# Altium schematic sheet MDL_FUENTE_5V.SchDoc
size A4
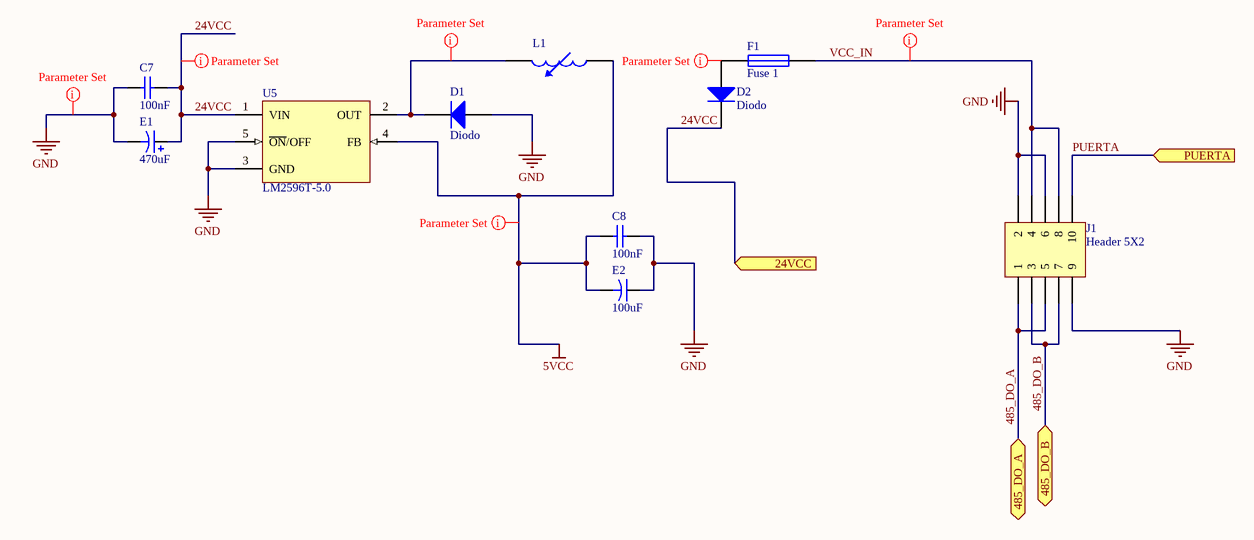
[diagram p0: MDL_FUENTE_5V.SchDoc]

## Parts
C7  value 100nF  [VP44-2.5]  (hidden comment: VP44BY224JB)
C8  value 100nF  [VP44-2.5]  (hidden comment: VP44BY224JB)
D1  Diodo  [1N4000]
D2  Diodo  [1N4000]
E1  value 470uF  [C1000UF]  (hidden comment: Cap Pol1)
E2  value 100uF  [C1UF]  (hidden comment: Cap2)
F1  Fuse 1  [FUSIBLE_BUSMATIC]
J1  Header 5X2  [FP_CON10]
L1  Inductor Adj  [Inductor_redondo]  (value not drawn)
U5  LM2596T-5.0  [FP_LM2596_D_PCB]

## Ports
24VCC (in), 485_DO_A, 485_DO_B, PUERTA (in)

## Nets
5VCC: C8.2 E2.2 L1.1 U5.4(FB)
GND: C7.2 C8.1 D1.1(A) E1.2 E2.1 J1.2 J1.6 J1.9 U5.3(GND) U5.5(~{ON}/OFF)
24VCC: C7.1 D2.2(K) E1.1 U5.1(VIN) ; port 24VCC
485_DO_A: J1.1 J1.5 ; port 485_DO_A
485_DO_B: J1.3 J1.7 ; port 485_DO_B
PUERTA: J1.10 ; port PUERTA
VCC_IN: F1.2 J1.4 J1.8
NetD1_2: D1.2(K) L1.2 U5.2(OUT)
NetD2_1: D2.1(A) F1.1

## Layout directives
rule Width Constraint [Pref Width = 1.2mm    Min Width = 0.8mm    Max Width = 1.5mm]: GND
rule Width Constraint [Pref Width = 1.5mm    Min Width = 1.2mm    Max Width = 2mm]: 24VCC, VCC_IN
rule Width Constraint [Pref Width = 1.2mm    Min Width = 0.8mm    Max Width = 1.5mm]; rule Undefined: 5VCC
rule Width Constraint [Pref Width = 1.5mm    Min Width = 0.8mm    Max Width = 1.5mm]: NetD1_2
rule Width Constraint [Pref Width = 1.8mm    Min Width = 1.2mm    Max Width = 2mm]: NetD2_1

## Library data of the parts
C7 C8 = VP44BY224JB: Dipped Radial Multilayer Ceramic Capacitor X7R: 220nF, 100V; Published: 17-Dec-2003; DatasheetDocument: 4-Feb-2002; PackageDocument: 4-Feb-2002; PackageReference: VP44-2.5; Publisher: Altium Limited; ComponentLink1Description: Manufacturer Link; ComponentLink1URL: http://www.vishay.com/
D1 D2 = Diodo: Diodo rectificador
E1 = Cap Pol1: Polarized Capacitor (Radial); Published: 8-Jun-2000; LatestRevisionDate: 17-Jul-2002; LatestRevisionNote: Re-released for DXP Platform.; PackageReference: RB7.6-15; Publisher: Altium Limited
E2 = Cap2: Capacitor; Published: 23-Sep-2002; PackageReference: CAPR5-4X5; Publisher: Altium Limited; PackageDescription: Capacitor; 2 Leads
F1 = Fuse 1: Fuse; Published: 8-Jun-2000; LatestRevisionDate: 17-Jul-2002; LatestRevisionNote: Re-released for DXP Platform.; PackageReference: PIN-W2/E2.8; Publisher: Altium Limited; PackageDescription: Thru-Hole; 2 Leads
J1 = Header 5X2: Header, 5-Pin, Dual row; LatestRevisionDate: 17-Jul-2002; LatestRevisionNote: Re-released for DXP Platform.; Publisher: Altium Limited
L1 = Inductor Adj: Adjustable Inductor; Value: 10mH; Set Position: 0.5; Published: 24-Mar-1999; LatestRevisionDate: 17-Jul-2002; LatestRevisionNote: Re-released for DXP Platform.; PackageReference: AXIAL-0.8; Publisher: Altium Limited
U5 = LM2596T-5.0: SIMPLE SWITCHER Power Converter 150 KHz 3A Step-Down Voltage Regulator; Manufacturer: National Semiconductor; PackageTopMarking: NSUZXYTT*LM2596T*-5.0 P+; PowerWise: N; FirstPublished: 4-Dec-2008; DatasheetVersion: May-2002; PackageVersion: revA, Oct-1989; PackageReference: T05D; Publisher: Altium Limited; PackageDescription: TO-220, Molded, Stagger Bend, 5 Lead; CompType: Switcher; PartNumber: LM2596T-5.0; RoHS: O; PinCount: 5; DigiKeyPartNumber: LM2596T-5.0-ND; ComponentLink1Description: LM2596 Datasheet; ComponentLink1URL: http://www.national.com/ds/LM/LM2596.pdf; ComponentLink2Description: LM2596 Web Page; ComponentLink2URL: http://www.national.com/pf/LM/LM2596.html; ComponentLink3Description: T05D Package Page; ComponentLink3URL: http://www.national.com/packaging/folders/t05d.html